# Altium schematic sheet Sheet1.SchDoc
size A4
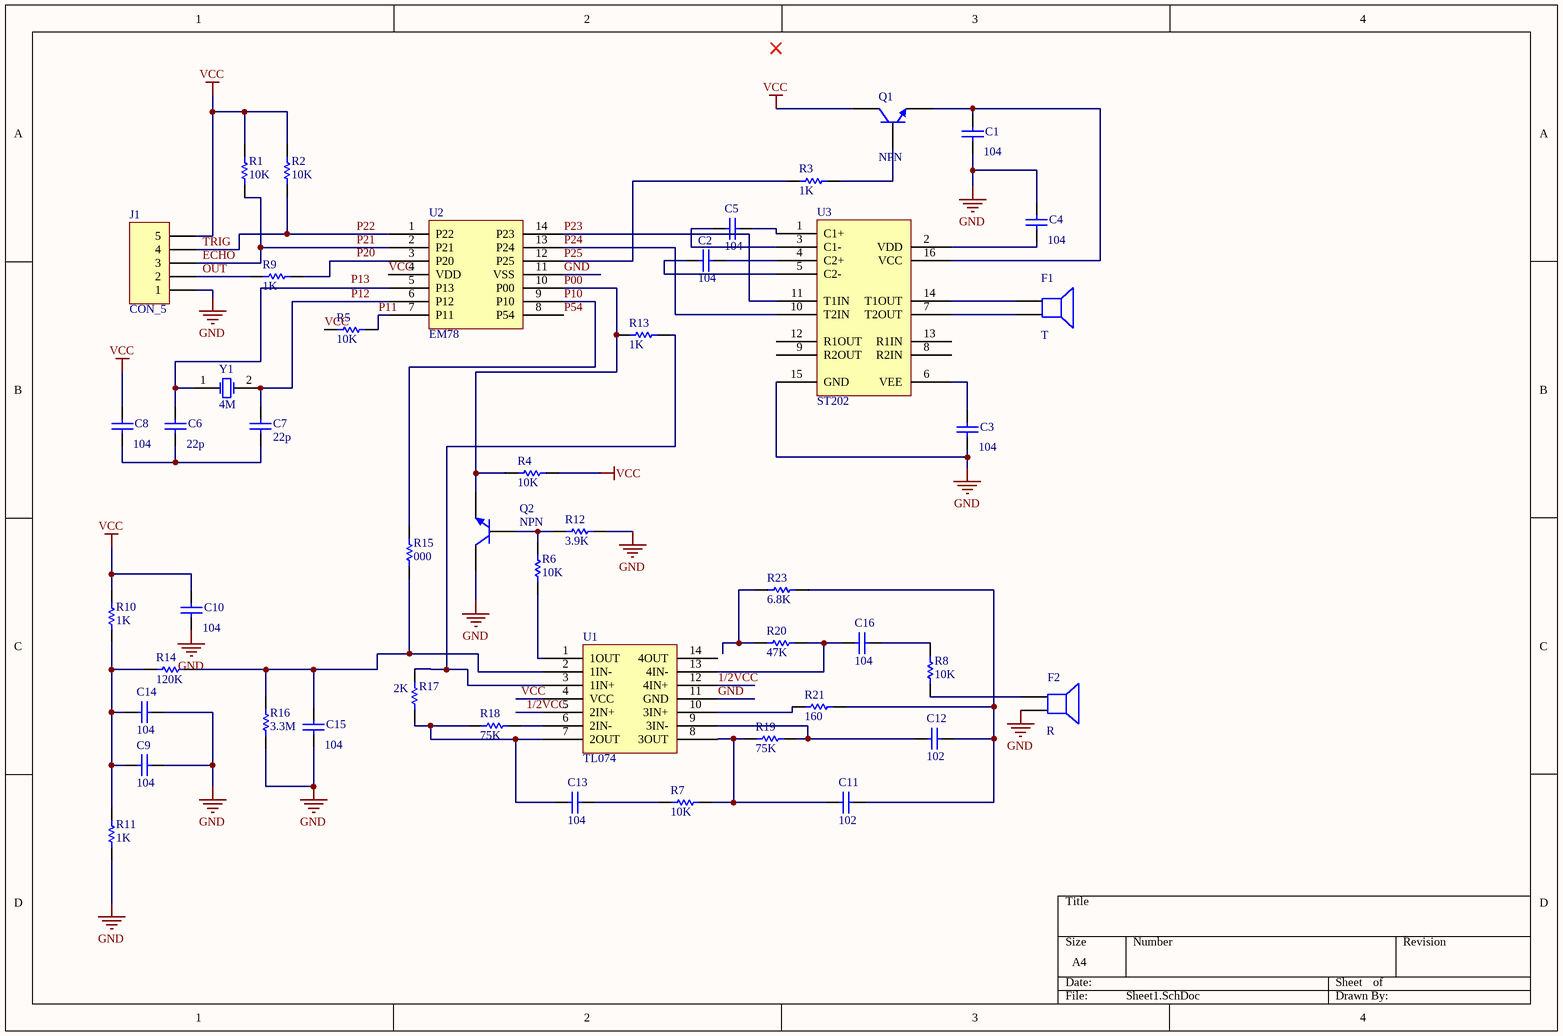
[diagram p0: Sheet1.SchDoc]

## Parts
C1  value 104  [1608[0603]]  (hidden comment: Cap)
C2  value 104  [1608[0603]]  (hidden comment: Cap)
C3  value 104  [1608[0603]]  (hidden comment: Cap)
C4  value 104  [1608[0603]]  (hidden comment: Cap)
C5  value 104  [1608[0603]]  (hidden comment: Cap)
C6  value 22p  [1608[0603]]  (hidden comment: Cap)
C7  value 22p  [1608[0603]]  (hidden comment: Cap)
C8  value 104  [1608[0603]]  (hidden comment: Cap)
C9  value 104  [1608[0603]]  (hidden comment: Cap)
C10  value 104  [1608[0603]]  (hidden comment: Cap)
C11  value 102  [1608[0603]]  (hidden comment: Cap)
C12  value 102  [1608[0603]]  (hidden comment: Cap)
C13  value 104  [1608[0603]]  (hidden comment: Cap)
C14  value 104  [1608[0603]]  (hidden comment: Cap)
C15  value 104  [1608[0603]]  (hidden comment: Cap)
C16  value 104  [1608[0603]]  (hidden comment: Cap)
F1  T  [laba]
F2  R  [laba]
J1  CON_5  [HDR1X5]
Q1  NPN  [SOT-23_M]
Q2  NPN  [SOT-23_M]
R1  value 10K  [1608[0603]]  (hidden comment: Res1)
R2  value 10K  [1608[0603]]  (hidden comment: Res1)
R3  value 1K  [1608[0603]]  (hidden comment: Res1)
R4  value 10K  [1608[0603]]  (hidden comment: Res1)
R5  value 10K  [1608[0603]]  (hidden comment: Res1)
R6  value 10K  [1608[0603]]  (hidden comment: Res1)
R7  value 10K  [1608[0603]]  (hidden comment: Res1)
R8  value 10K  [1608[0603]]  (hidden comment: Res1)
R9  value 1K  [1608[0603]]  (hidden comment: Res1)
R10  value 1K  [1608[0603]]  (hidden comment: Res1)
R11  value 1K  [1608[0603]]  (hidden comment: Res1)
R12  value 3.9K  [1608[0603]]  (hidden comment: Res1)
R13  value 1K  [1608[0603]]  (hidden comment: Res1)
R14  value 120K  [1608[0603]]  (hidden comment: Res1)
R15  value 000  [1608[0603]]  (hidden comment: Res1)
R16  value 3.3M  [1608[0603]]  (hidden comment: Res1)
R17  value 2K  [1608[0603]]  (hidden comment: Res1)
R18  value 75K  [1608[0603]]  (hidden comment: Res1)
R19  value 75K  [1608[0603]]  (hidden comment: Res1)
R20  value 47K  [1608[0603]]  (hidden comment: Res1)
R21  value 160  [1608[0603]]  (hidden comment: Res1)
R23  value 6.8K  [1608[0603]]  (hidden comment: Res1)
U1  TL074  [SO_14]
U2  EM78  [SO_14]
U3  ST202  [SO-16_L]
Y1  4M  [jingzhen]

## Nets
GND: C1.1 C3.1 C4.2 C9.1 C10.1 C14.1 C15.1 F2.2 J1.1 Q2.1(C) R11.2 R12.2 R16.2 U1.11(GND) U2.11(VSS) U3.15(GND)
VCC: C8.2 C10.2 J1.5 Q1.1(C) R1.2 R2.2 R4.2 R5.2 R10.1 U1.4(VCC) U2.4(VDD)
1/2VCC: U1.5(2IN+) U1.12(4IN+)
ECHO: J1.3 R1.1 U2.2(P21)  [also labelled P21]
OUT: J1.2 R9.2
P00: Q2.3(E) R4.1 R13.2 U2.10(P00)
P10: R15.1 U2.9(P10)
P11: R5.1 U2.7(P11)
P12: C7.1 U2.6(P12) Y1.2(OSC2)
P20: R9.1 U2.3(P20)
P22: J1.4 R2.1 U2.1(P22)  [also labelled TRIG]
P23: U2.14(P23) U3.11(T1IN)
P24: U2.13(P24) U3.10(T2IN)
P25: R3.2 U2.12(P25)
P54: U2.8(P54)
NetC1_2: C1.2 Q1.3(E) U3.16(VCC)
NetC2_1: C2.1 U3.4(C2+)
NetC2_2: C2.2 U3.5(C2-)
NetC3_2: C3.2 U3.6(VEE)
NetC4_1: C4.1 U3.2(VDD)
NetC5_1: C5.1 U3.1(C1+)
NetC5_2: C5.2 U3.3(C1-)
NetC6_1: C6.1 C7.2 C8.1
NetC6_2: C6.2 U2.5(P13) Y1.1(OSC1)
NetC9_2: C9.2 C14.2 R10.2 R11.1 R14.1
NetC11_1: C11.1 C12.1 R21.1 R23.2
NetC11_2: C11.2 R7.2 R19.1 U1.8(3OUT)
NetC12_2: C12.2 R19.2 U1.9(3IN-)
NetC13_1: C13.1 R7.1
NetC13_2: C13.2 R17.2 R18.1 U1.7(2OUT)
NetC15_2: C15.2 R14.2 R15.2 R16.1 U1.2(1IN-)
NetC16_1: C16.1 R8.2
NetC16_2: C16.2 R20.2 U1.13(4IN-)
NetF1_1: F1.1 U3.14(T1OUT)
NetF1_2: F1.2 U3.7(T2OUT)
NetF2_1: F2.1 R8.1
NetQ1_2: Q1.2(B) R3.1
NetQ2_2: Q2.2(B) R6.1 R12.1
NetR6_2: R6.2 U1.1(1OUT)
NetR13_1: R13.1 R17.1 U1.3(1IN+)
NetR18_2: R18.2 U1.6(2IN-)
NetR20_1: R20.1 R23.1
NetR21_2: R21.2 U1.10(3IN+)

Not connected (* = marked no-connect by the designer): U1 14(4OUT); U3 8(R2IN) 9(R2OUT) 12(R1OUT) 13(R1IN)

## Notes on the sheet
- Labels drawn without touching a wire or pin: P13

## Library data of the parts
C1-C16 = Cap: Capacitor; Published: 8-Jun-2000; LatestRevisionDate: 17-Jul-2002; LatestRevisionNote: Re-released for DXP Platform.; PackageReference: RAD-0.3; Publisher: Altium Limited; PackageDescription: Radial Cap, Thru-Hole; 2 Leads; 0.3 in Pin Spacing
F1 F2 = Speaker: Loudspeaker; Published: 24-Mar-1999; LatestRevisionDate: 17-Jul-2002; LatestRevisionNote: Re-released for DXP Platform.; PackageReference: PIN2; Publisher: Altium Limited
J1 = Header 5: Header, 5-Pin; LatestRevisionDate: 17-Jul-2002; LatestRevisionNote: Re-released for DXP Platform.; Publisher: Altium Limited
Q1 Q2 = NPN: NPN Bipolar Transistor; pin to pad: 1>2 2>1; Published: 8-Jun-2000; LatestRevisionDate: 17-Jul-2002; LatestRevisionNote: Re-released for DXP Platform.; PackageReference: TO-226-AA; Publisher: Altium Limited; PackageDescription: TO, Flat Index; 3 In-Line, Axial Leads; Body Dia. 4.8mm; Leads 0.55 x 0.51 mm (max); Code_JEDEC: TO-226-AA
R1-R21 R23 = Res1: Resistor; Published: 8-Jun-2000; LatestRevisionDate: 17-Jul-2002; LatestRevisionNote: Re-released for DXP Platform.; PackageReference: AXIAL-0.3; Publisher: Altium Limited; PackageDescription: Axial Device, Thru-Hole; 2 Leads; 0.3 in Pin Spacing
Y1 = XTAL: Crystal Oscillator; Published: 8-Jun-2000; LatestRevisionDate: 17-Jul-2002; LatestRevisionNote: Re-released for DXP Platform.; PackageReference: R38; Publisher: Altium Limited; PackageDescription: Crystal, Thru-Hole; 2 Leads; Body 3.1 x 8.2 mm (Dia.xH)